# Altium schematic sheet 原理总图.SchDoc
size A1; PageSetup: Record=PageOptions|CenterHorizontal=True|CenterVertical=True|PrintScale=1.00|XCorrection=1.00|YCorrection=1.00|PrintKind=1|BorderSize=5000000|LeftOffset=0|BottomOffset=0|Orientation=2|PaperLength=1000|PaperWidth=1000|Scale=100|PaperSource=7|PrintQuality=-4|MediaType=1|DitherType=10|PaperKind=A4|PrintScaleMode=1
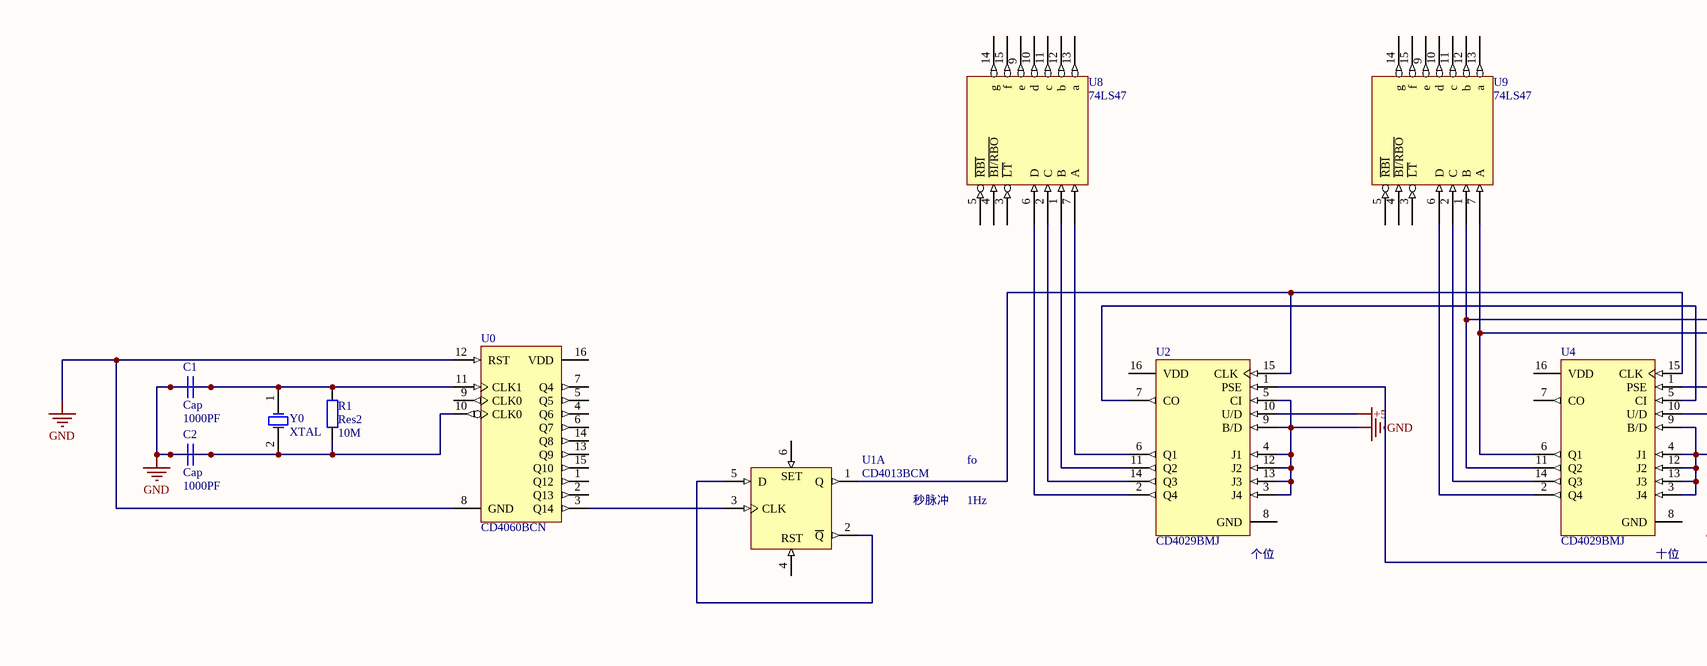
[diagram p0: 原理总图.SchDoc, left]
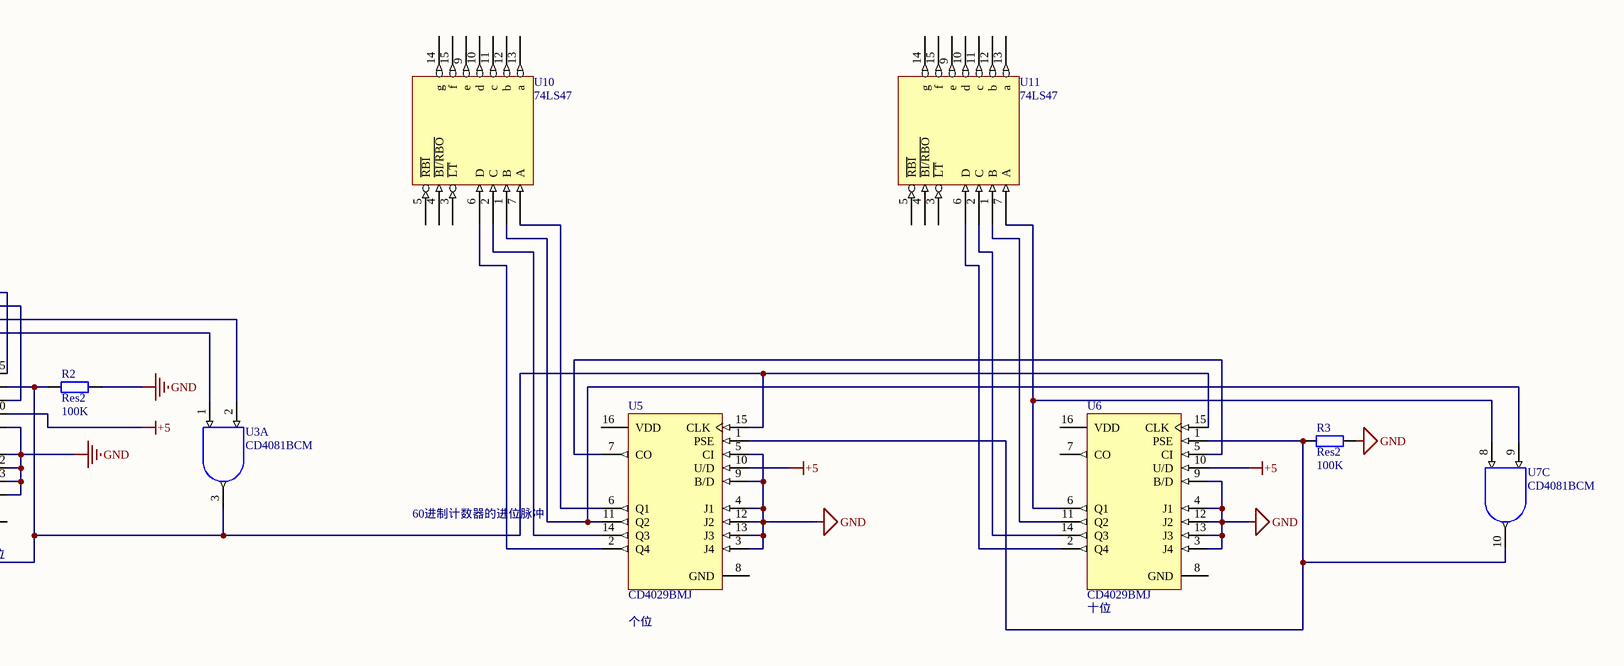
[diagram p1: 原理总图.SchDoc, right]

## Parts
C1  Cap  value 1000PF  [RAD-0.3]
C2  Cap  value 1000PF  [RAD-0.3]
R1  Res2  value 10M  [AXIAL-0.4]
R2  Res2  value 100K  [AXIAL-0.4]
R3  Res2  value 100K  [AXIAL-0.4]
U0  CD4060BCN  [N16E]
U1  CD4013BCM  [M14A_N]  (part A of 2)
U2  CD4029BMJ  [J16A]
U3  CD4081BCM  [M14A_N]  (part A of 4)
U4  CD4029BMJ  [J16A]
U5  CD4029BMJ  [J16A]
U6  CD4029BMJ  [J16A]
U7  CD4081BCM  [M14A_N]  (part C of 4)
U8  74LS47  [DIP-16]
U9  74LS47  [DIP-16]
U10  74LS47  [DIP-16]
U11  74LS47  [DIP-16]
Y0  XTAL  [R38]

## Nets
+5: U2.10(U/D) U4.10(U/D) U5.10(U/D) U6.10(U/D)
GND: C1.1 C1.2 C2.1 C2.2 R1.1 R1.2 R2.1 R3.1 U0.8(GND) U0.10(CLK0) U0.11(CLK1) U0.12(RST) U1.7(GND) U2.3(J4) U2.4(J1) U2.5(CI) U2.9(B/D) U2.12(J2) U2.13(J3) U3.7(GND) U4.3(J4) U4.4(J1) U4.9(B/D) U4.12(J2) U4.13(J3) U5.3(J4) U5.4(J1) U5.5(CI) U5.9(B/D) U5.12(J2) U5.13(J3) U6.3(J4) U6.4(J1) U6.9(B/D) U6.12(J2) U6.13(J3) U7.7(GND) U8.8(GND) U9.8(GND) U10.8(GND) U11.8(GND) Y0.1(OSC1) Y0.2(OSC2)
VCC: U8.16(VCC) U9.16(VCC) U10.16(VCC) U11.16(VCC)
VDD: U1.14(VDD) U3.14(VDD) U7.14(VDD)
NetR2_2: R2.2 U2.1(PSE) U3.3(J) U4.1(PSE) U5.15(CLK) U6.15(CLK)
NetR3_2: R3.2 U5.1(PSE) U6.1(PSE) U7.10(J)
NetU0_3: U0.3(Q14) U1.3(CLK)
NetU1_1: U1.1(Q) U2.15(CLK) U4.15(CLK)
NetU1_2: U1.2(~{Q}) U1.5(D)
NetU2_2: U2.2(Q4) U8.6(D)
NetU2_6: U2.6(Q1) U8.7(A)
NetU2_7: U2.7(CO) U4.5(CI)
NetU2_11: U2.11(Q2) U8.1(B)
NetU2_14: U2.14(Q3) U8.2(C)
NetU3_1: U3.1(A) U4.6(Q1) U9.7(A)
NetU3_2: U3.2(B) U4.11(Q2) U9.1(B)
NetU4_2: U4.2(Q4) U9.6(D)
NetU4_14: U4.14(Q3) U9.2(C)
NetU5_2: U5.2(Q4) U10.6(D)
NetU5_6: U5.6(Q1) U10.7(A)
NetU5_7: U5.7(CO) U6.5(CI)
NetU5_11: U5.11(Q2) U7.9(B) U10.1(B)
NetU5_14: U5.14(Q3) U10.2(C)
NetU6_2: U6.2(Q4) U11.6(D)
NetU6_6: U6.6(Q1) U7.8(A) U11.7(A)
NetU6_11: U6.11(Q2) U11.1(B)
NetU6_14: U6.14(Q3) U11.2(C)

Not connected (* = marked no-connect by the designer): U0 1(Q12) 2(Q13) 4(Q6) 5(Q5) 6(Q7) 7(Q4) 9(CLK0) 13(Q9) 14(Q8) 15(Q10) 16(VDD); U1 4(RST) 6(S); U2 8(GND) 16(VDD); U4 7(CO) 8(GND) 16(VDD); U5 8(GND) 16(VDD); U6 7(CO) 8(GND) 16(VDD); U8 3(~{LT}) 4(~{BI/RBO}) 5(~{RBI}) 9(e) 10(d) 11(c) 12(b) 13(a) 14(g) 15(f); U9 3(~{LT}) 4(~{BI/RBO}) 5(~{RBI}) 9(e) 10(d) 11(c) 12(b) 13(a) 14(g) 15(f); U10 3(~{LT}) 4(~{BI/RBO}) 5(~{RBI}) 9(e) 10(d) 11(c) 12(b) 13(a) 14(g) 15(f); U11 3(~{LT}) 4(~{BI/RBO}) 5(~{RBI}) 9(e) 10(d) 11(c) 12(b) 13(a) 14(g) 15(f)

## Notes on the sheet
- fo
- 秒脉冲
- 1Hz
- 60进制计数器的进位脉冲
- (near U2) 个位
- (near U4) 十位
- (near U5) 个位
- (near U6) 十位
- (in symbol CD4013BCM, part A) SET

## Library data of the parts
C1 C2 = Cap: Capacitor; Published: 8-Jun-2000; LatestRevisionDate: 17-Jul-2002; LatestRevisionNote: Re-released for DXP Platform.; PackageReference: RAD-0.3; Publisher: Altium Limited; PackageDescription: Radial Cap, Thru-Hole; 2 Leads; 0.3 in Pin Spacing
R1-R3 = Res2: Resistor; Published: 8-Jun-2000; LatestRevisionDate: 17-Jul-2002; LatestRevisionNote: Re-released for DXP Platform.; PackageReference: AXIAL-0.4; Publisher: Altium Limited; PackageDescription: Axial Device, Thru-Hole; 2 Leads; 0.4 in Pin Spacing
U0 = CD4060BCN: 14-Stage Ripple Carry Binary Counter; Published: 15-Apr-2002; LatestRevisionDate: 06-Jun-2005; LatestRevisionNote: Stylized 3D Model Added.; DatasheetVersion: Jan-1999; PackageVersion: 2000; PackageReference: N16E; Publisher: Altium Limited; PackageDescription: DIP; 16 Leads; Row Spacing 7.62 mm; Pitch 2.54 mm; ComponentLink1Description: Manufacturer Link; ComponentLink1URL: http://www.national.com/; ComponentLink2Description: Datasheet; ComponentLink2URL: http://www.national.com/ds.cgi/CD/CD4020BC.pdf; ComponentLink3Description: URL Link1; ComponentLink3URL: http://www.national.com/pf/CD/CD4060BM.html
U1 = CD4013BCM: Dual D-Type Flip-Flop; Published: 17-Jul-2002; LatestRevisionDate: 13-Apr-2006; LatestRevisionNote: IPC-7351 Footprint Added.; DatasheetVersion: Jan-1999; PackageVersion: 2000; PackageReference: M14A; Publisher: Altium Limited; PackageDescription: 14-Pin Small Outline Integrated Circuit 1.27 mm Pitch; Code_IPC: SOIC127P600-14; ComponentLink1Description: Manufacturer Link; ComponentLink1URL: http://www.fairchildsemi.com/
U2 U4-U6 = CD4029BMJ: Binary/Decade Up/Down Counter; Published: 15-Apr-2002; LatestRevisionDate: 06-Jun-2005; LatestRevisionNote: Stylized 3D Model Added.; DatasheetVersion: Jan-1999; PackageVersion: 2000; PackageReference: J16A; Publisher: Altium Limited; PackageDescription: DIP; 16 Leads; Row Spacing 7.62 mm; Pitch 2.54 mm; ComponentLink1Description: Manufacturer Link; ComponentLink1URL: http://www.national.com/; ComponentLink2Description: Datasheet; ComponentLink2URL: http://www.national.com/ds.cgi/CD/CD4029BC.pdf; ComponentLink3Description: URL Link1; ComponentLink3URL: http://www.national.com/pf/CD/CD4029BM.html
U3 U7 = CD4081BCM: Quad 2-Input AND Buffered B series Gate, 14-Pin SOIC; IC_Technology: C; Published: 17-Jul-2002; LatestRevisionDate: 13-Apr-2006; LatestRevisionNote: IPC-7351 Footprint Added.; DatasheetVersion: Jan-1999; PackageVersion: 2000; PackageReference: M14A; Publisher: Altium Limited; PackageDescription: 14-Pin Small Outline Integrated Circuit 1.27 mm Pitch; Code_IPC: SOIC127P600-14; ComponentLink1Description: Manufacturer Link; ComponentLink1URL: http://www.fairchildsemi.com/; ComponentLink2Description: Datasheet; ComponentLink2URL: http://www.fairchildsemi.com/ds/CD%2FCD4071BC.pdf
Y0 = XTAL: Crystal Oscillator; Published: 8-Jun-2000; LatestRevisionDate: 17-Jul-2002; LatestRevisionNote: Re-released for DXP Platform.; PackageReference: R38; Publisher: Altium Limited; PackageDescription: Crystal, Thru-Hole; 2 Leads; Body 3.1 x 8.2 mm (Dia.xH)